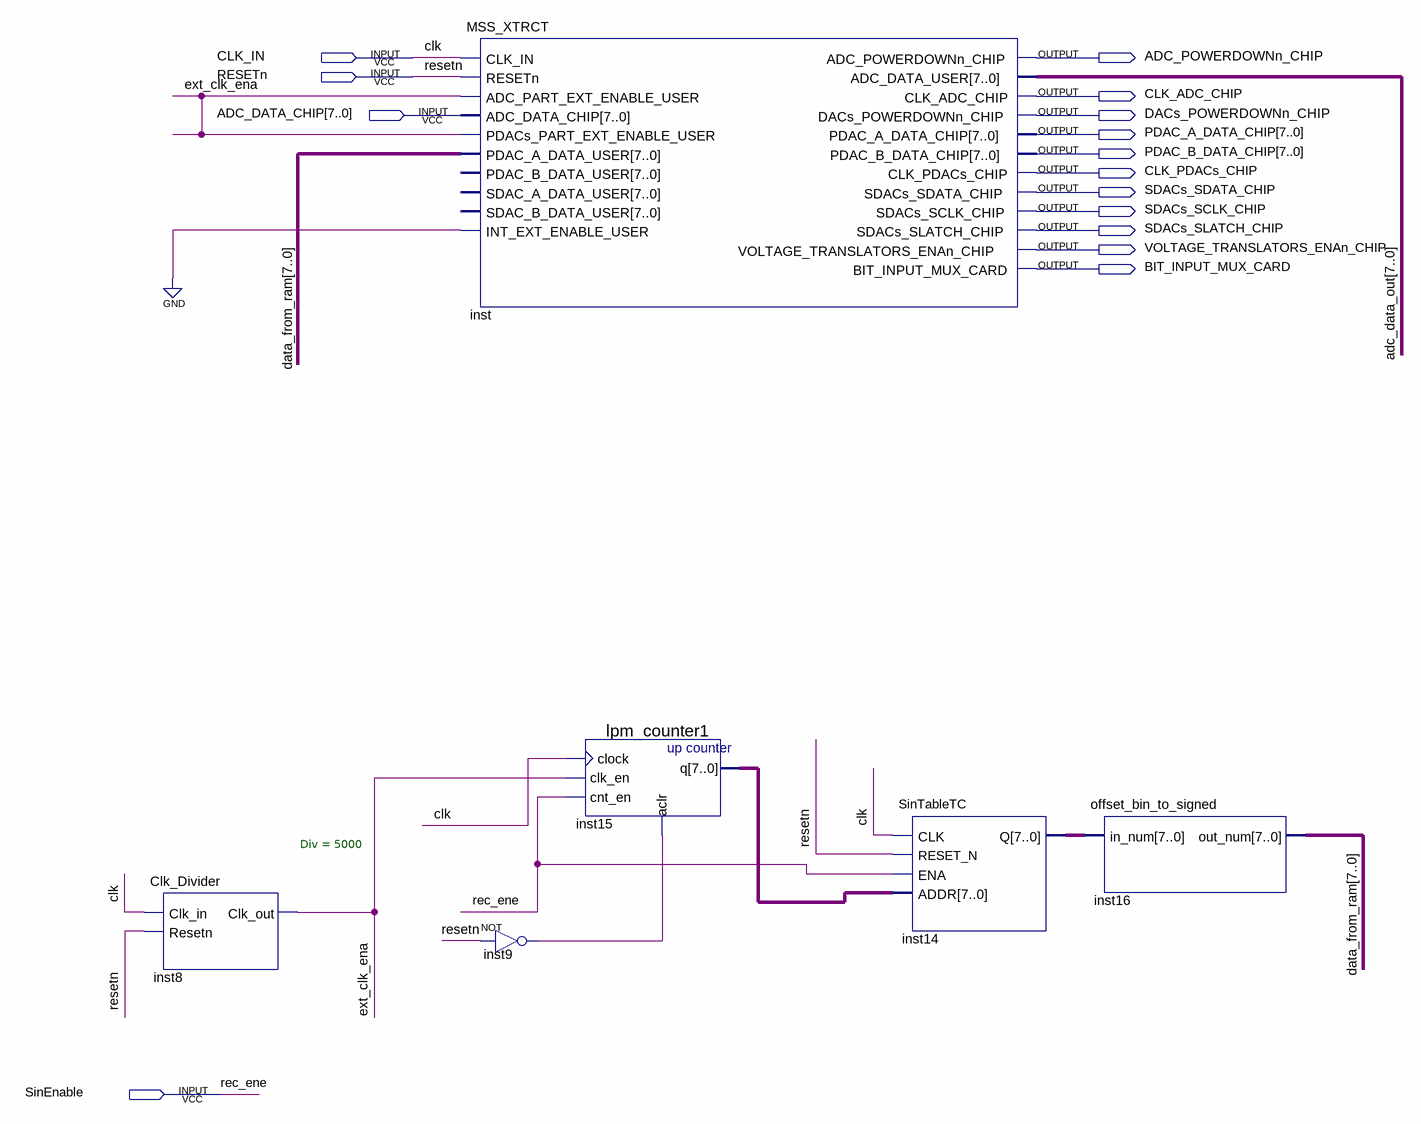
[diagram p0: schematic sheet]
// Quartus schematic signal_gen.bdf as structural Verilog: 6 symbols, 15 pins
module signal_gen (
  input  CLK_IN,
  input  RESETn,
  input  [7:0] ADC_DATA_CHIP,
  input  SinEnable,
  output ADC_POWERDOWNn_CHIP,
  output CLK_ADC_CHIP,
  output DACs_POWERDOWNn_CHIP,
  output [7:0] PDAC_A_DATA_CHIP,
  output [7:0] PDAC_B_DATA_CHIP,
  output CLK_PDACs_CHIP,
  output SDACs_SDATA_CHIP,
  output SDACs_SCLK_CHIP,
  output SDACs_SLATCH_CHIP,
  output VOLTAGE_TRANSLATORS_ENAn_CHIP,
  output BIT_INPUT_MUX_CARD
);

  wire ext_clk_ena, inst9_out;
  wire [7:0] adc_data_out, data_from_ram, inst14_q, inst15_q;

  Clk_Divider #(.Div(5000)) inst8 (.Clk_in(CLK_IN), .Resetn(RESETn), .Clk_out(ext_clk_ena));
  MSS_XTRCT inst (
    .CLK_IN(CLK_IN), .RESETn(RESETn), .ADC_PART_EXT_ENABLE_USER(ext_clk_ena), .ADC_DATA_CHIP(ADC_DATA_CHIP),
    .PDACs_PART_EXT_ENABLE_USER(ext_clk_ena), .PDAC_A_DATA_USER(data_from_ram), .INT_EXT_ENABLE_USER(1'b0),
    .ADC_POWERDOWNn_CHIP(ADC_POWERDOWNn_CHIP), .ADC_DATA_USER(adc_data_out), .CLK_ADC_CHIP(CLK_ADC_CHIP),
    .DACs_POWERDOWNn_CHIP(DACs_POWERDOWNn_CHIP), .PDAC_A_DATA_CHIP(PDAC_A_DATA_CHIP),
    .PDAC_B_DATA_CHIP(PDAC_B_DATA_CHIP), .CLK_PDACs_CHIP(CLK_PDACs_CHIP),
    .SDACs_SDATA_CHIP(SDACs_SDATA_CHIP), .SDACs_SCLK_CHIP(SDACs_SCLK_CHIP),
    .SDACs_SLATCH_CHIP(SDACs_SLATCH_CHIP), .VOLTAGE_TRANSLATORS_ENAn_CHIP(VOLTAGE_TRANSLATORS_ENAn_CHIP),
    .BIT_INPUT_MUX_CARD(BIT_INPUT_MUX_CARD));  // open: PDAC_B_DATA_USER, SDAC_A_DATA_USER, SDAC_B_DATA_USER
  not inst9 (inst9_out, RESETn);
  lpm_counter1 inst15 (.clock(CLK_IN), .clk_en(ext_clk_ena), .cnt_en(SinEnable), .aclr(inst9_out), .q(inst15_q));
  SinTableTC inst14 (.CLK(CLK_IN), .RESET_N(RESETn), .ENA(SinEnable), .ADDR(inst15_q), .Q(inst14_q));
  offset_bin_to_signed inst16 (.in_num(inst14_q), .out_num(data_from_ram));

  // Other names for the same wires on the sheet: clk = CLK_IN; rec_ene = SinEnable
endmodule
